# EAGLE board open-source-ruler (EAGLE 6.5.0)
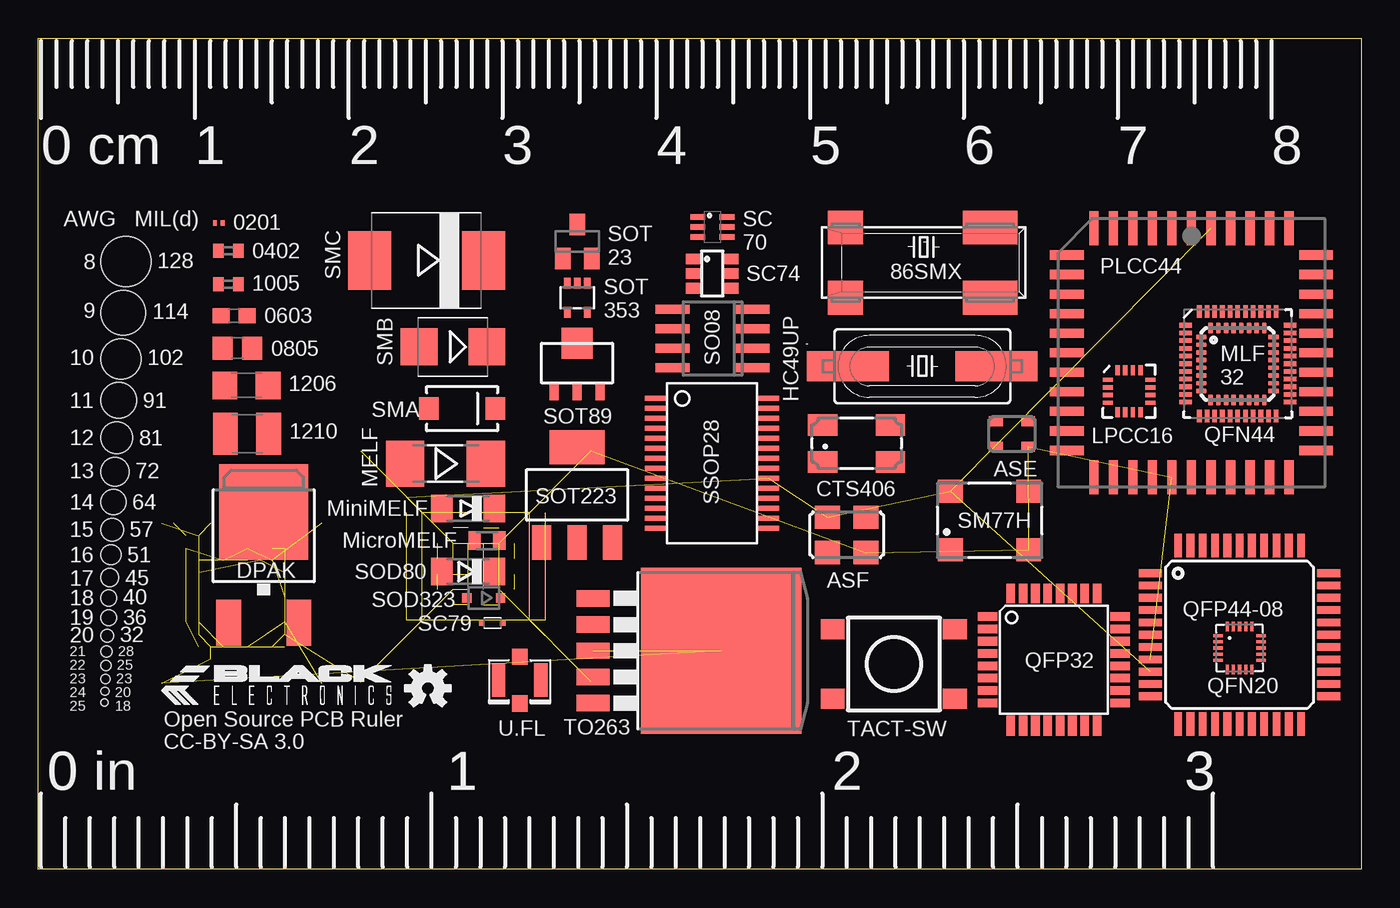
[diagram p2: board, top side]
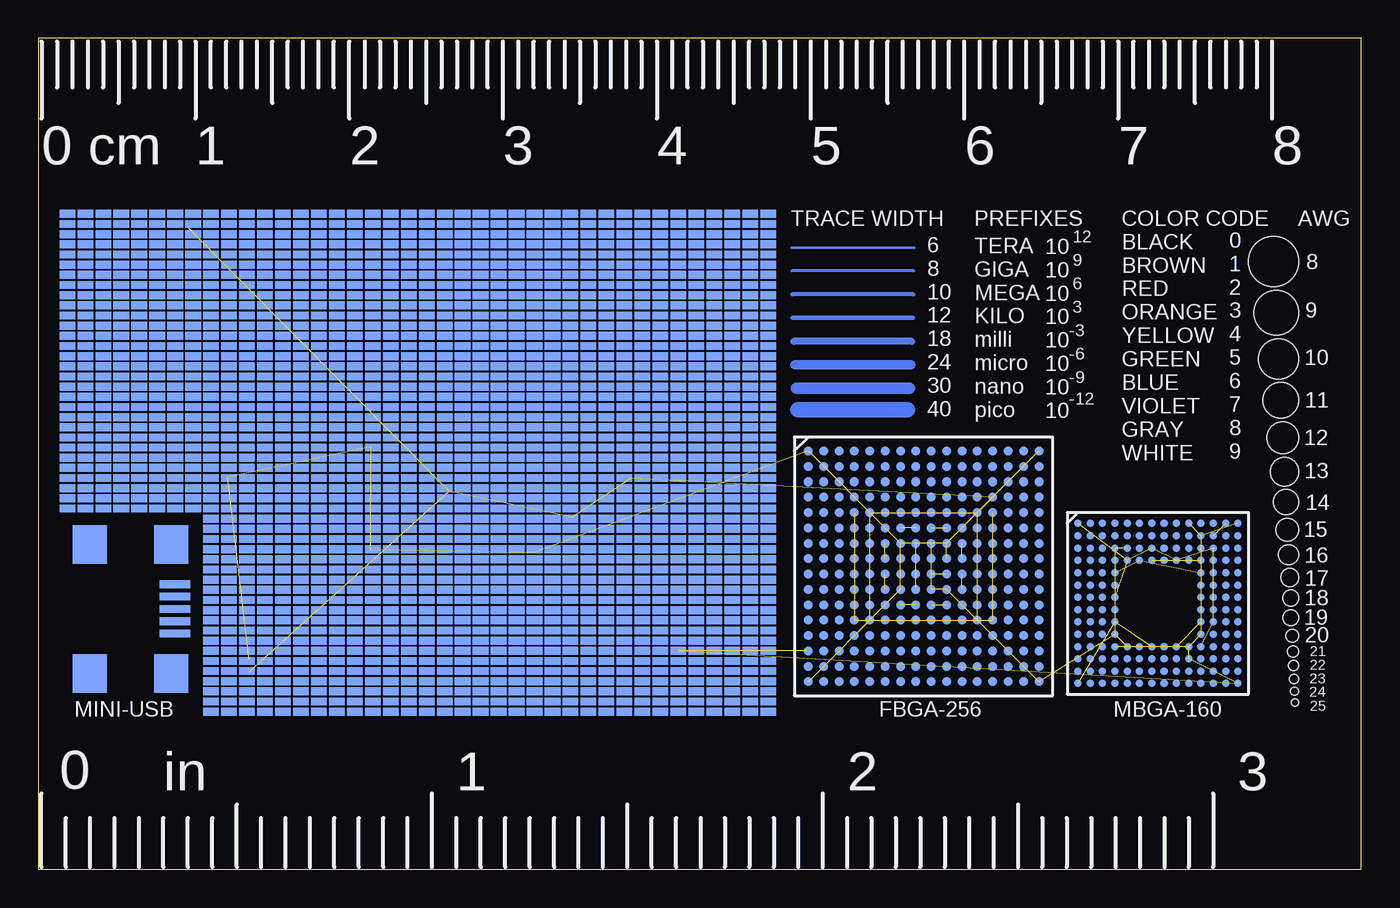
[diagram p3: board, bottom side, seen from below]

Size 86 x 54 mm. Coordinates in mm from the lower left corner, seen from the top.
Outline: 0,0 0,54 86,54 86,0 0,0
Copper layers (1*16): Top 0.035mm / dielectric 1.5mm / Bottom 0.035mm
Design rules "Fusion_eagle_rule_v1.1": minimum track width 6mil, minimum drill 12mil, track to track 6mil, track to pad 6mil, pad to pad 6mil, via to via 6mil, smd to smd 0mil, copper to edge 10mil, drill to drill 10mil, minimum pad ring 10mil, minimum via ring 6mil, stop-mask expansion 2mil, vias tented up to drill 100mil, thermal gap 10mil
Holes 3.25 mm at 5.69,39.5
Holes 2.9 mm at 5.51,36.17
Holes 2.59 mm at 5.36,33.17
Holes 2.3 mm at 5.21,30.47
Holes 2.05 mm at 5.09,28.04
Holes 1.83 mm at 4.98,25.84
Holes 1.63 mm at 4.88,23.86
Holes 1.45 mm at 4.79,22.06
Holes 1.29 mm at 4.71,20.44
Holes 1.15 mm at 4.64,18.96
Holes 1.02 mm at 4.57,17.63 4.57,16.36
Holes 0.81 mm at 4.47,15.18
Holes 0.71 mm at 4.42,14.17
Holes 0.64 mm at 4.38,13.24
Holes 0.58 mm at 4.36,12.37
Holes 0.51 mm at 4.32,11.57
Holes 0.46 mm at 4.29,10.83

## Footprints (pad centres in the part's own frame; a part is rotated, then mirrored left to right if it is on the bottom)
C0201 = smd 0.25 x 0.35: 1 -0.25,0; 2 0.25,0
C0402 = smd 0.7 x 0.9: 1 -0.65,0; 2 0.65,0
C0603 = smd 1.1 x 1: 1 -0.85,0; 2 0.85,0
C0805 = smd 1.3 x 1.5: 1 -0.95,0; 2 0.95,0
C1005 = smd 0.7 x 0.9: 1 -0.65,0; 2 0.65,0
C1206 = smd 1.6 x 1.8: 1 -1.4,0; 2 1.4,0
C1210 = smd 1.6 x 2.7: 1 -1.4,0; 2 1.4,0
MICROMELF-R = smd 0.8 x 1.2: A 0.8,0; C -0.8,0
SOD323-R = smd 0.6 x 0.6: A 1.1,0; C -1.1,0
SOD80C = smd 1.4 x 1.8: A 1.7,0; C -1.7,0
SMA-DIODE = smd 1.27 x 1.47: A -2.15,0; C 2.15,0
SMB = smd 2.4 x 2.4: A 2.2,0; C -2.2,0
SMC = smd 2.8 x 3.8: A 3.7,0; C -3.7,0
MELF-MLL41 = smd 2.5 x 3: A 2.625,0; C -2.625,0
MINIMELF = smd 1.4 x 1.8: A 1.7,0; C -1.7,0
SO08 = smd 0.6 x 2.2: 1 -1.905,-2.6; 2 -0.635,-2.6; 3 0.635,-2.6; 4 1.905,-2.6; 5 1.905,2.6; 6 0.635,2.6; 7 -0.635,2.6; 8 -1.905,2.6
SSOP28DB = smd 0.348 x 1.397: 1 -4.225,-3.656; 2 -3.575,-3.656; 3 -2.925,-3.656; 4 -2.275,-3.656; 5 -1.625,-3.656; 6 -0.975,-3.656; 7 -0.325,-3.656; 8 0.325,-3.656; 9 0.975,-3.656; 10 1.625,-3.656; 11 2.275,-3.656; 12 2.925,-3.656; 13 3.575,-3.656; 14 4.225,-3.656; 15 4.225,3.656; 16 3.575,3.656; 17 2.925,3.656; 18 2.275,3.656; 19 1.625,3.656; 20 0.975,3.656; 21 0.325,3.656; 22 -0.325,3.656; 23 -0.975,3.656; 24 -1.625,3.656; 25 -2.275,3.656; 26 -2.925,3.656; 27 -3.575,3.656; 28 -4.225,3.656
SC-74 = smd 0.7 x 1: 1 -0.95,-1.2; 2 0,-1.2; 3 0.95,-1.2; 4 0.95,1.2; 5 0,1.2; 6 -0.95,1.2
TQFP44 = smd 1.5 x 0.5: 1 -5.8,4; 2 -5.8,3.2; 3 -5.8,2.4; 4 -5.8,1.6; 5 -5.8,0.8; 6 -5.8,0; 7 -5.8,-0.8; 8 -5.8,-1.6; 9 -5.8,-2.4; 10 -5.8,-3.2; 11 -5.8,-4; 23 5.8,-4; 24 5.8,-3.2; 25 5.8,-2.4; 26 5.8,-1.6; 27 5.8,-0.8; 28 5.8,0; 29 5.8,0.8; 30 5.8,1.6; 31 5.8,2.4; 32 5.8,3.2; 33 5.8,4 | smd 0.5 x 1.5: 12 -4,-5.8; 13 -3.2,-5.8; 14 -2.4,-5.8; 15 -1.6,-5.8; 16 -0.8,-5.8; 17 0,-5.8; 18 0.8,-5.8; 19 1.6,-5.8; 20 2.4,-5.8; 21 3.2,-5.8; 22 4,-5.8; 34 4,5.8; 35 3.2,5.8; 36 2.4,5.8; 37 1.6,5.8; 38 0.8,5.8; 39 0,5.8; 40 -0.8,5.8; 41 -1.6,5.8; 42 -2.4,5.8; 43 -3.2,5.8; 44 -4,5.8
FPBGA_256 = smd 0.6 x 0.6: A1 -7.5,7.5; A2 -6.5,7.5; A3 -5.5,7.5; A4 -4.5,7.5; A5 -3.5,7.5; A6 -2.5,7.5; A7 -1.5,7.5; A8 -0.5,7.5; A9 0.5,7.5; A10 1.5,7.5; A11 2.5,7.5; A12 3.5,7.5; A13 4.5,7.5; A14 5.5,7.5; A15 6.5,7.5; A16 7.5,7.5; B1 -7.5,6.5; B2 -6.5,6.5; B3 -5.5,6.5; B4 -4.5,6.5; B5 -3.5,6.5; B6 -2.5,6.5; B7 -1.5,6.5; B8 -0.5,6.5; B9 0.5,6.5; B10 1.5,6.5; B11 2.5,6.5; B12 3.5,6.5; B13 4.5,6.5; B14 5.5,6.5; B15 6.5,6.5; B16 7.5,6.5; C1 -7.5,5.5; C2 -6.5,5.5; C3 -5.5,5.5; C4 -4.5,5.5; C5 -3.5,5.5; C6 -2.5,5.5; C7 -1.5,5.5; C8 -0.5,5.5; C9 0.5,5.5; C10 1.5,5.5; C11 2.5,5.5; C12 3.5,5.5; C13 4.5,5.5; C14 5.5,5.5; C15 6.5,5.5; C16 7.5,5.5; D1 -7.5,4.5; D2 -6.5,4.5; D3 -5.5,4.5; D4 -4.5,4.5; D5 -3.5,4.5; D6 -2.5,4.5; D7 -1.5,4.5; D8 -0.5,4.5; D9 0.5,4.5; D10 1.5,4.5; D11 2.5,4.5; D12 3.5,4.5; D13 4.5,4.5; D14 5.5,4.5; D15 6.5,4.5; D16 7.5,4.5; E1 -7.5,3.5; E2 -6.5,3.5; E3 -5.5,3.5; E4 -4.5,3.5; E5 -3.5,3.5; E6 -2.5,3.5; E7 -1.5,3.5; E8 -0.5,3.5; E9 0.5,3.5; E10 1.5,3.5; E11 2.5,3.5; E12 3.5,3.5; E13 4.5,3.5; E14 5.5,3.5; E15 6.5,3.5; E16 7.5,3.5; F1 -7.5,2.5; F2 -6.5,2.5; F3 -5.5,2.5; F4 -4.5,2.5; F5 -3.5,2.5; F6 -2.5,2.5; F7 -1.5,2.5; F8 -0.5,2.5; F9 0.5,2.5; F10 1.5,2.5; F11 2.5,2.5; F12 3.5,2.5; F13 4.5,2.5; F14 5.5,2.5; F15 6.5,2.5; F16 7.5,2.5; G1 -7.5,1.5; G2 -6.5,1.5; G3 -5.5,1.5; G4 -4.5,1.5; G5 -3.5,1.5; G6 -2.5,1.5; G7 -1.5,1.5; G8 -0.5,1.5; G9 0.5,1.5; G10 1.5,1.5; G11 2.5,1.5; G12 3.5,1.5; G13 4.5,1.5; G14 5.5,1.5; G15 6.5,1.5; G16 7.5,1.5; H1 -7.5,0.5; H2 -6.5,0.5; H3 -5.5,0.5; H4 -4.5,0.5; H5 -3.5,0.5; H6 -2.5,0.5; H7 -1.5,0.5; H8 -0.5,0.5; H9 0.5,0.5; H10 1.5,0.5; H11 2.5,0.5; H12 3.5,0.5; H13 4.5,0.5; H14 5.5,0.5; H15 6.5,0.5; H16 7.5,0.5; J1 -7.5,-0.5; J2 -6.5,-0.5; J3 -5.5,-0.5; J4 -4.5,-0.5; J5 -3.5,-0.5; J6 -2.5,-0.5; J7 -1.5,-0.5; J8 -0.5,-0.5; J9 0.5,-0.5; J10 1.5,-0.5; J11 2.5,-0.5; J12 3.5,-0.5; J13 4.5,-0.5; J14 5.5,-0.5; J15 6.5,-0.5; J16 7.5,-0.5; K1 -7.5,-1.5; K2 -6.5,-1.5; K3 -5.5,-1.5; K4 -4.5,-1.5; K5 -3.5,-1.5; K6 -2.5,-1.5; K7 -1.5,-1.5; K8 -0.5,-1.5; K9 0.5,-1.5; K10 1.5,-1.5; K11 2.5,-1.5; K12 3.5,-1.5; K13 4.5,-1.5; K14 5.5,-1.5; K15 6.5,-1.5; K16 7.5,-1.5; L1 -7.5,-2.5; L2 -6.5,-2.5; L3 -5.5,-2.5; L4 -4.5,-2.5; L5 -3.5,-2.5; L6 -2.5,-2.5; L7 -1.5,-2.5; L8 -0.5,-2.5; L9 0.5,-2.5; L10 1.5,-2.5; L11 2.5,-2.5; L12 3.5,-2.5; L13 4.5,-2.5; L14 5.5,-2.5; L15 6.5,-2.5; L16 7.5,-2.5; M1 -7.5,-3.5; M2 -6.5,-3.5; M3 -5.5,-3.5; M4 -4.5,-3.5; M5 -3.5,-3.5; M6 -2.5,-3.5; M7 -1.5,-3.5; M8 -0.5,-3.5; M9 0.5,-3.5; M10 1.5,-3.5; M11 2.5,-3.5; M12 3.5,-3.5; M13 4.5,-3.5; M14 5.5,-3.5; M15 6.5,-3.5; M16 7.5,-3.5; N1 -7.5,-4.5; N2 -6.5,-4.5; N3 -5.5,-4.5; N4 -4.5,-4.5; N5 -3.5,-4.5; N6 -2.5,-4.5; N7 -1.5,-4.5; N8 -0.5,-4.5; N9 0.5,-4.5; N10 1.5,-4.5; N11 2.5,-4.5; N12 3.5,-4.5; N13 4.5,-4.5; N14 5.5,-4.5; N15 6.5,-4.5; N16 7.5,-4.5; P1 -7.5,-5.5; P2 -6.5,-5.5; P3 -5.5,-5.5; P4 -4.5,-5.5; P5 -3.5,-5.5; P6 -2.5,-5.5; P7 -1.5,-5.5; P8 -0.5,-5.5; P9 0.5,-5.5; P10 1.5,-5.5; P11 2.5,-5.5; P12 3.5,-5.5; P13 4.5,-5.5; P14 5.5,-5.5; P15 6.5,-5.5; P16 7.5,-5.5; R1 -7.5,-6.5; R2 -6.5,-6.5; R3 -5.5,-6.5; R4 -4.5,-6.5; R5 -3.5,-6.5; R6 -2.5,-6.5; R7 -1.5,-6.5; R8 -0.5,-6.5; R9 0.5,-6.5; R10 1.5,-6.5; R11 2.5,-6.5; R12 3.5,-6.5; R13 4.5,-6.5; R14 5.5,-6.5; R15 6.5,-6.5; R16 7.5,-6.5; T1 -7.5,-7.5; T2 -6.5,-7.5; T3 -5.5,-7.5; T4 -4.5,-7.5; T5 -3.5,-7.5; T6 -2.5,-7.5; T7 -1.5,-7.5; T8 -0.5,-7.5; T9 0.5,-7.5; T10 1.5,-7.5; T11 2.5,-7.5; T12 3.5,-7.5; T13 4.5,-7.5; T14 5.5,-7.5; T15 6.5,-7.5; T16 7.5,-7.5
PLCC44 = smd 0.6 x 2.2: 1 0,8.1; 2 -1.27,8.1; 3 -2.54,8.1; 4 -3.81,8.1; 5 -5.08,8.1; 6 -6.35,8.1; 18 -6.35,-8.1; 19 -5.08,-8.1; 20 -3.81,-8.1; 21 -2.54,-8.1; 22 -1.27,-8.1; 23 0,-8.1; 24 1.27,-8.1; 25 2.54,-8.1; 26 3.81,-8.1; 27 5.08,-8.1; 28 6.35,-8.1; 40 6.35,8.1; 41 5.08,8.1; 42 3.81,8.1; 43 2.54,8.1; 44 1.27,8.1 | smd 2.2 x 0.6: 7 -8.1,6.35; 8 -8.1,5.08; 9 -8.1,3.81; 10 -8.1,2.54; 11 -8.1,1.27; 12 -8.1,0; 13 -8.1,-1.27; 14 -8.1,-2.54; 15 -8.1,-3.81; 16 -8.1,-5.08; 17 -8.1,-6.35; 29 8.1,-6.35; 30 8.1,-5.08; 31 8.1,-3.81; 32 8.1,-2.54; 33 8.1,-1.27; 34 8.1,0; 35 8.1,1.27; 36 8.1,2.54; 37 8.1,3.81; 38 8.1,5.08; 39 8.1,6.35
MBGA_160 = smd 0.5 x 0.5: A1 -5.2,5.2; A2 -4.4,5.2; A3 -3.6,5.2; A4 -2.8,5.2; A5 -2,5.2; A6 -1.2,5.2; A7 -0.4,5.2; A8 0.4,5.2; A9 1.2,5.2; A10 2,5.2; A11 2.8,5.2; A12 3.6,5.2; A13 4.4,5.2; A14 5.2,5.2; B1 -5.2,4.4; B2 -4.4,4.4; B3 -3.6,4.4; B4 -2.8,4.4; B5 -2,4.4; B6 -1.2,4.4; B7 -0.4,4.4; B8 0.4,4.4; B9 1.2,4.4; B10 2,4.4; B11 2.8,4.4; B12 3.6,4.4; B13 4.4,4.4; B14 5.2,4.4; C1 -5.2,3.6; C2 -4.4,3.6; C3 -3.6,3.6; C4 -2.8,3.6; C5 -2,3.6; C6 -1.2,3.6; C7 -0.4,3.6; C8 0.4,3.6; C9 1.2,3.6; C10 2,3.6; C11 2.8,3.6; C12 3.6,3.6; C13 4.4,3.6; C14 5.2,3.6; D1 -5.2,2.8; D2 -4.4,2.8; D3 -3.6,2.8; D4 -2.8,2.8; D5 -2,2.8; D6 -1.2,2.8; D7 -0.4,2.8; D8 0.4,2.8; D9 1.2,2.8; D10 2,2.8; D11 2.8,2.8; D12 3.6,2.8; D13 4.4,2.8; D14 5.2,2.8; E1 -5.2,2; E2 -4.4,2; E3 -3.6,2; E4 -2.8,2; E11 2.8,2; E12 3.6,2; E13 4.4,2; E14 5.2,2; F1 -5.2,1.2; F2 -4.4,1.2; F3 -3.6,1.2; F4 -2.8,1.2; F11 2.8,1.2; F12 3.6,1.2; F13 4.4,1.2; F14 5.2,1.2; G1 -5.2,0.4; G2 -4.4,0.4; G3 -3.6,0.4; G4 -2.8,0.4; G11 2.8,0.4; G12 3.6,0.4; G13 4.4,0.4; G14 5.2,0.4; H1 -5.2,-0.4; H2 -4.4,-0.4; H3 -3.6,-0.4; H4 -2.8,-0.4; H11 2.8,-0.4; H12 3.6,-0.4; H13 4.4,-0.4; H14 5.2,-0.4; J1 -5.2,-1.2; J2 -4.4,-1.2; J3 -3.6,-1.2; J4 -2.8,-1.2; J11 2.8,-1.2; J12 3.6,-1.2; J13 4.4,-1.2; J14 5.2,-1.2; K1 -5.2,-2; K2 -4.4,-2; K3 -3.6,-2; K4 -2.8,-2; K11 2.8,-2; K12 3.6,-2; K13 4.4,-2; K14 5.2,-2; L1 -5.2,-2.8; L2 -4.4,-2.8; L3 -3.6,-2.8; L4 -2.8,-2.8; L5 -2,-2.8; L6 -1.2,-2.8; L7 -0.4,-2.8; L8 0.4,-2.8; L9 1.2,-2.8; L10 2,-2.8; L11 2.8,-2.8; L12 3.6,-2.8; L13 4.4,-2.8; L14 5.2,-2.8; M1 -5.2,-3.6; M2 -4.4,-3.6; M3 -3.6,-3.6; M4 -2.8,-3.6; M5 -2,-3.6; M6 -1.2,-3.6; M7 -0.4,-3.6; M8 0.4,-3.6; M9 1.2,-3.6; M10 2,-3.6; M11 2.8,-3.6; M12 3.6,-3.6; M13 4.4,-3.6; M14 5.2,-3.6; N1 -5.2,-4.4; N2 -4.4,-4.4; N3 -3.6,-4.4; N4 -2.8,-4.4; N5 -2,-4.4; N6 -1.2,-4.4; N7 -0.4,-4.4; N8 0.4,-4.4; N9 1.2,-4.4; N10 2,-4.4; N11 2.8,-4.4; N12 3.6,-4.4; N13 4.4,-4.4; N14 5.2,-4.4; P1 -5.2,-5.2; P2 -4.4,-5.2; P3 -3.6,-5.2; P4 -2.8,-5.2; P5 -2,-5.2; P6 -1.2,-5.2; P7 -0.4,-5.2; P8 0.4,-5.2; P9 1.2,-5.2; P10 2,-5.2; P11 2.8,-5.2; P12 3.6,-5.2; P13 4.4,-5.2; P14 5.2,-5.2
SOT223 = smd 1.219 x 2.235: 1 -2.311,-3.099; 2 0,-3.099; 3 2.311,-3.099 | smd 3.6 x 2.2: 4 0,3.099
TO263-5 = smd 1.067 x 2.159: 1 -3.404,-5.791; 2 -1.702,-5.791; 3 0,-5.791; 4 1.702,-5.791; 5 3.404,-5.791 | smd 10.8 x 10.41: 6 0,2.54
SOT23 = smd 1 x 1.4: 1 -0.95,-1.1; 2 0.95,-1.1; 3 0,1.1
HC49UP = smd 5.334 x 1.93: 1 -4.826,0; 2 4.826,0
86SMX = smd 2.286 x 2.184: 1 -5.08,-2.286; 4 -5.08,2.286 | smd 3.556 x 2.184: 2 4.318,-2.286; 3 4.318,2.286
ASF = smd 1.6 x 1.5: 1 -1.25,-1.15; 2 1.25,-1.15; 3 1.25,1.15; 4 -1.25,1.15
CTS406 = smd 1.9 x 1.4: 1 -2.2,-1.2; 2 2.2,-1.2; 3 2.2,1.2; 4 -2.2,1.2
SOT89 = smd 0.58 x 1.2: 1 -1.5,-1.8; 2 0,-1.8; 3 1.5,-1.8 | smd 2 x 2: 4 0,1.3
QFN-20-0.4MM = smd 0.6 x 0.2: 1 -1.4,0.8; 2 -1.4,0.4; 3 -1.4,0; 4 -1.4,-0.4; 5 -1.4,-0.8; 11 1.4,-0.8; 12 1.4,-0.4; 13 1.4,0; 14 1.4,0.4; 15 1.4,0.8 | smd 0.2 x 0.6: 6 -0.8,-1.4; 7 -0.4,-1.4; 8 0,-1.4; 9 0.4,-1.4; 10 0.8,-1.4; 16 0.8,1.4; 17 0.4,1.4; 18 0,1.4; 19 -0.4,1.4; 20 -0.8,1.4
SM77H = smd 1.6 x 1.5: 1 -2.55,-1.9; 2 2.55,-1.9; 3 2.55,1.9; 4 -2.55,1.9
TACTILE_SWITCH_TALL = smd 1.55 x 1.3: A1 -3.975,-2.25; A2 3.975,-2.25; B1 -3.975,2.25; B2 3.975,2.25
SC79_INFINEON = smd 0.35 x 0.35: A 0.675,0; C -0.675,0
V-REG_DPACK = smd 1.6 x 3: 1 -2.28,-4.8; 3 2.28,-4.8 | smd 5.8 x 6.2: 4 0,2.38
TQFP32-08 = smd 1.27 x 0.559: 1 -4.293,2.8; 2 -4.293,2; 3 -4.293,1.2; 4 -4.293,0.4; 5 -4.293,-0.4; 6 -4.293,-1.2; 7 -4.293,-2; 8 -4.293,-2.8; 17 4.293,-2.8; 18 4.293,-2; 19 4.293,-1.2; 20 4.293,-0.4; 21 4.293,0.4; 22 4.293,1.2; 23 4.293,2; 24 4.293,2.8 | smd 0.559 x 1.27: 9 -2.8,-4.293; 10 -2,-4.293; 11 -1.2,-4.293; 12 -0.4,-4.293; 13 0.4,-4.293; 14 1.2,-4.293; 15 2,-4.293; 16 2.8,-4.293; 25 2.8,4.293; 26 2,4.293; 27 1.2,4.293; 28 0.4,4.293; 29 -0.4,4.293; 30 -1.2,4.293; 31 -2,4.293; 32 -2.8,4.293
MLF32 = smd 0.7 x 0.3: 1 -2.35,1.75; 2 -2.35,1.25; 3 -2.35,0.75; 4 -2.35,0.25; 5 -2.35,-0.25; 6 -2.35,-0.75; 7 -2.35,-1.25; 8 -2.35,-1.75; 17 2.35,-1.75; 18 2.35,-1.25; 19 2.35,-0.75; 20 2.35,-0.25; 21 2.35,0.25; 22 2.35,0.75; 23 2.35,1.25; 24 2.35,1.75 | smd 0.3 x 0.7: 9 -1.75,-2.35; 10 -1.25,-2.35; 11 -0.75,-2.35; 12 -0.25,-2.35; 13 0.25,-2.35; 14 0.75,-2.35; 15 1.25,-2.35; 16 1.75,-2.35; 25 1.75,2.35; 26 1.25,2.35; 27 0.75,2.35; 28 0.25,2.35; 29 -0.25,2.35; 30 -0.75,2.35; 31 -1.25,2.35; 32 -1.75,2.35
SOT353 = smd 0.42 x 0.7: 1 -0.65,-0.95; 2 0,-0.95; 3 0.65,-0.95; 4 0.65,0.95; 5 -0.65,0.95
SC-70 = smd 0.36 x 0.95: 1 -0.65,-0.95; 2 0,-0.95; 3 0.65,-0.95; 4 0.65,0.95; 5 0,0.95; 6 -0.65,0.95
ASE = smd 0.9 x 0.65: 1 -1.05,-0.825; 2 1.05,-0.825; 3 1.05,0.825; 4 -1.05,0.825
PADS = smd 1.016 x 0.508: P$1 -4.089,2.972; P$2 -5.258,2.311; P$3 -4.089,2.311; P$4 -2.921,2.972; P$5 -1.753,2.972; P$6 -0.584,2.972; P$7 -5.258,1.651; P$8 -2.921,2.311; P$9 -1.753,2.311; P$10 -0.584,2.311; P$11 -4.089,1.651; P$12 -5.258,0.991; P$13 -4.089,0.991; P$14 -2.921,1.651; P$15 -1.753,1.651; P$16 -0.584,1.651; P$17 -2.921,0.991; P$18 -1.753,0.991; P$19 -0.584,0.991; P$20 -5.258,0.33; P$21 -4.089,0.33; P$22 -5.258,-0.33; P$23 -4.089,-0.33; P$24 -2.921,0.33; P$25 -1.753,0.33; P$26 -0.584,0.33; P$27 -2.921,-0.33; P$28 -1.753,-0.33; P$29 -0.584,-0.33; P$30 -5.258,-0.991; P$31 -4.089,-0.991; P$32 -5.258,-1.651; P$33 -4.089,-1.651; P$34 -2.921,-0.991; P$35 -1.753,-0.991; P$36 -0.584,-0.991; P$37 -2.921,-1.651; P$38 -1.753,-1.651; P$39 -0.584,-1.651; P$40 0.584,2.972; P$41 1.753,2.972; P$42 0.584,2.311; P$43 1.753,2.311; P$44 2.921,2.972; P$45 4.089,2.972; P$46 5.258,2.972; P$47 2.921,2.311; P$48 4.089,2.311; P$49 5.258,2.311; P$50 0.584,1.651; P$51 1.753,1.651; P$52 0.584,0.991; P$53 1.753,0.991; P$54 2.921,1.651; P$55 4.089,1.651; P$56 5.258,1.651; P$57 2.921,0.991; P$58 4.089,0.991; P$59 5.258,0.991; P$60 0.584,0.33; P$61 1.753,0.33; P$62 0.584,-0.33; P$63 1.753,-0.33; P$64 2.921,0.33; P$65 4.089,0.33; P$66 5.258,0.33; P$67 2.921,-0.33; P$68 4.089,-0.33; P$69 5.258,-0.33; P$70 0.584,-0.991; P$71 1.753,-0.991; P$72 0.584,-1.651; P$73 1.753,-1.651; P$74 2.921,-0.991; P$75 4.089,-0.991; P$76 5.258,-0.991; P$77 2.921,-1.651; P$78 4.089,-1.651; P$79 5.258,-1.651; P$80 -5.258,-2.311; P$81 -4.089,-2.311; P$82 -5.258,-2.972; P$83 -4.089,-2.972; P$84 -2.921,-2.311; P$85 -1.753,-2.311; P$86 -0.584,-2.311; P$87 -2.921,-2.972; P$88 -1.753,-2.972; P$89 -0.584,-2.972; P$90 0.584,-2.311; P$91 1.753,-2.311; P$92 0.584,-2.972; P$93 1.753,-2.972; P$94 2.921,-2.311; P$95 4.089,-2.311; P$96 5.258,-2.311; P$97 2.921,-2.972; P$98 4.089,-2.972; P$99 5.258,-2.972; P$101 -5.258,2.972
QFN-44-NOPAD = smd 0.8 x 0.3: 1 -3.4,2.5; 2 -3.4,2; 3 -3.4,1.5; 4 -3.4,1; 5 -3.4,0.5; 6 -3.4,0; 7 -3.4,-0.5; 8 -3.4,-1; 9 -3.4,-1.5; 10 -3.4,-2; 11 -3.4,-2.5; 23 3.4,-2.5; 24 3.4,-2; 25 3.4,-1.5; 26 3.4,-1; 27 3.4,-0.5; 28 3.4,0; 29 3.4,0.5; 30 3.4,1; 31 3.4,1.5; 32 3.4,2; 33 3.4,2.5 | smd 0.3 x 0.8: 12 -2.5,-3.4; 13 -2,-3.4; 14 -1.5,-3.4; 15 -1,-3.4; 16 -0.5,-3.4; 17 0,-3.4; 18 0.5,-3.4; 19 1,-3.4; 20 1.5,-3.4; 21 2,-3.4; 22 2.5,-3.4; 34 2.5,3.4; 35 2,3.4; 36 1.5,3.4; 37 1,3.4; 38 0.5,3.4; 39 0,3.4; 40 -0.5,3.4; 41 -1,3.4; 42 -1.5,3.4; 43 -2,3.4; 44 -2.5,3.4
16LPCC = smd 0.65 x 0.28: 1 -1.37,0.75; 2 -1.37,0.25; 3 -1.37,-0.25; 4 -1.37,-0.75; 9 1.37,-0.75; 10 1.37,-0.25; 11 1.37,0.25; 12 1.37,0.75 | smd 0.28 x 0.65: 5 -0.75,-1.37; 6 -0.25,-1.37; 7 0.25,-1.37; 8 0.75,-1.37; 13 0.75,1.37; 14 0.25,1.37; 15 -0.25,1.37; 16 -0.75,1.37
U.FL = smd 2.2 x 0.85: P$1 0,1.375; P$2 0,-1.375 | smd 1.05 x 1: P$3 1.525,0; P$4 -1.525,0
UX60A-MB-5ST = smd 2 x 0.5: 1 2.25,1.6; 2 2.25,0.8; 3 2.25,0; 4 2.25,-0.8; 5 2.25,-1.6 | smd 2.2 x 2.5: M1 -3.3,-4.2; M2 -3.3,4.2; M3 2,4.2; M4 2,-4.2

## Placement (x,y rotation side)
0201  [C0201]  11.73,42.02 0 top
0402  [C0402]  12.35,40.21 0 top
0603  [C0603]  12.73,35.98 0 top
0805  [C0805]  12.93,33.88 0 top
1005  [C1005]  12.35,38.03 0 top
1206  [C1206]  13.54,31.45 0 top
1210  [C1210]  13.57,28.31 0 top
D1  [MICROMELF-R]  29.16,21.36 180 top
D2  [SOD323-R]  28.95,17.63 180 top
D3  [SOD80C]  27.94,19.34 180 top
D4  [SMA-DIODE]  27.55,29.94 0 top
D5  [SMB]  26.95,33.95 180 top
D6  [SMC]  25.24,39.58 180 top
D7  [MELF-MLL41]  26.47,26.37 180 top
D8  [MINIMELF]  27.94,23.44 180 top
IC1  LT1007CS8  [SO08]  43.84,34.5 90 top
IC2  FT232RLSSOP  [SSOP28DB]  43.8,26.39 270 top
IC3  MDC3105DMT1  [SC-74]  43.81,38.72 270 top
IC4  XMEGA16A4A  [TQFP44]  78.11,15.24 0 top
IC5  LFXP20E_XXF256  [FPBGA_256]  28.45,19.68 0 bottom
IC6  [PLCC44]  74.98,33.57 0 top
IC7  ADSP_BF531  [MBGA_160]  13.21,17.27 0 bottom
IC8  [SOT223]  35.03,24.33 0 top
IC9  [TO263-5]  41.86,14.2 270 top
Q1  [SOT23]  35.04,40.8 0 top
Q2  [HC49UP]  57.48,32.7 0 top
Q3  [86SMX]  57.56,39.43 0 top
Q4  ASF1  [ASF]  52.56,21.74 0 top
Q5  [CTS406]  53.2,27.68 0 top
Q6  [SOT89]  35.03,32.89 0 top
QFN20  [QFN-20-0.4MM]  78.11,14.38 0 top
QG1  SM77H  [SM77H]  61.85,22.68 0 top
S1  SWITCH-MOMENTARY-2  [TACTILE_SWITCH_TALL]  55.63,13.34 0 top
SC79  [SC79_INFINEON]  29.52,16 180 top
U1  V_REG_317DPACK  [V-REG_DPACK]  14.65,20.83 0 top
U2  ATMEGA168  [TQFP32-08]  66.03,13.62 0 top
U3  ATMEGA168MLF  [MLF32]  77.97,32.84 0 top
U4  7432SE  [SOT353]  35.04,37.15 180 top
U$1  OSHW-LOGOS  [OSHW-LOGO-S]  25.32,11.76 0 top
U$2  ADM1087SC-70  [SC-70]  43.83,41.75 270 top
U$3  ASE  [ASE]  63.31,28.29 0 top
U$4  PADS  [PADS]  67.18,13.21 0 bottom
U$5  ATMEGA32U4QFN2  [QFN-44-NOPAD]  77.98,32.86 0 top
U$6  PADS  [PADS]  78.87,39.62 0 bottom
U$7  PADS  [PADS]  78.87,33.02 0 bottom
U$8  PADS  [PADS]  78.87,26.42 0 bottom
U$9  PADS  [PADS]  55.5,13.21 0 bottom
U$10  PADS  [PADS]  67.18,39.62 0 bottom
U$11  PADS  [PADS]  67.18,33.02 0 bottom
U$12  PADS  [PADS]  67.18,26.42 0 bottom
U$13  PADS  [PADS]  67.18,19.81 0 bottom
U$14  PADS  [PADS]  55.5,19.81 0 bottom
U$15  PADS  [PADS]  55.5,26.42 0 bottom
U$16  PADS  [PADS]  55.5,33.02 0 bottom
U$17  PADS  [PADS]  55.5,39.62 0 bottom
U$18  PADS  [PADS]  43.81,39.62 0 bottom
U$19  PADS  [PADS]  43.81,33.02 0 bottom
U$20  PADS  [PADS]  43.81,26.42 0 bottom
U$21  PADS  [PADS]  43.81,19.81 0 bottom
U$22  PADS  [PADS]  43.81,13.21 0 bottom
U$23  PADS  [PADS]  69.52,19.81 0 bottom
U$24  PADS  [PADS]  69.52,13.21 0 bottom
U$25  HMC5883LSMD  [16LPCC]  70.92,31.06 0 top
U$26  U.FL  [U.FL]  31.29,12.29 270 top
U$27  LOGO_SMALL  [LOGO_SMALL]  8,10.69 0 top
X1  MINI-USB-UX60A-MB-5ST  [UX60A-MB-5ST]  79.38,16.92 0 bottom

## Tracks (layer width: path | path; a pad name or v marks a point on that pad's centre or on a via)
GND  (54 unrouted)
N$1
  Bottom 0.152: 29.06,40.41 37.03,40.41
N$2
  Bottom 0.203: 29.08,38.89 37.01,38.89
N$3
  Bottom 0.254: 29.11,37.36 36.98,37.36
N$4
  Bottom 0.305: 29.13,35.84 36.96,35.84
N$5
  Bottom 0.457: 29.21,34.31 36.88,34.31
N$6
  Bottom 0.61: 29.29,32.79 36.8,32.79
N$7
  Bottom 0.762: 29.36,31.27 36.73,31.27
N$8
  Bottom 1.016: 29.49,29.87 36.6,29.87
VCC  (12 unrouted)
VCCAUX  (3 unrouted)
VCCIO0  (1 unrouted)
VCCIO1  (1 unrouted)
VCCIO2  (1 unrouted)
VCCIO3  (1 unrouted)
VCCIO4  (1 unrouted)
VCCIO5  (1 unrouted)
VCCIO6  (1 unrouted)
VCCIO7  (1 unrouted)
VDD_EXT  (11 unrouted)
VDD_INT  (5 unrouted)
VROUT  (1 unrouted)

## Text on the board
tPlace: 0 | cm | 1 | 2 | 3 | 4 | 5 | 6 | 7 | 8 | AWG | MIL(d) | 0201 | 0402 | SC / 70 | 8 | 128 | SOT / 23 | PLCC44 | 1005 | SMC | SC74 | 86SMX | 9 | 114 | SOT / 353 | 0603 | 10 | 102 | 0805 | SMB | SO08 | 1206 | MLF / 32 | 11 | 91 | HC49UP | SMA | SOT89 | 12 | 81 | 1210 | LPCC16 | QFN44 | ASE | 13 | 72 | MELF | SOT223 | SSOP28 | CTS406 | 14 | 64 | MiniMELF | 15 | 57 | SM77H | MicroMELF | 16 | 51 | DPAK | SOD80 | 17 | 45 | ASF | 18 | 40 | SOD323 | 19 | 36 | QFP44-08 | 20 | 32 | SC79 | 21 | 28 | 22 | 25 | QFP32 | 23 | 23 | 24 | 20 | QFN20 | 25 | 18 | Open Source PCB Ruler | U.FL | TO263 | TACT-SW | CC-BY-SA 3.0 | 0 | 0 | in | 1 | 1 | 2 | 3 | 3
bPlace: 8 | 7 | 6 | 5 | 4 | 3 | 2 | 1 | cm | 0 | AWG | PREFIXES | TRACE WIDTH | 12 | 8 | 9 | 6 | 9 | 3 | -3 | 10 | -6 | -9 | 11 | -12 | 10 / 10 / 10 / 10 / 10 / 10 / 10 / 10 | TERA / GIGA / MEGA / KILO / milli / micro / nano / pico | 6 / 8 / 10 / 12 / 18 / 24 / 30 / 40 | 12 | 0 / 1 / 2 / 3 / 4 / 5 / 6 / 7 / 8 / 9 | COLOR CODE / BLACK / BROWN / RED / ORANGE / YELLOW / GREEN / BLUE / VIOLET / GRAY / WHITE | 13 | 14 | 15 | 16 | 17 | 18 | 19 | 20 | 21 | 22 | 23 | 24 | 25 | MBGA-160 | FBGA-256 | MINI-USB | 3 | 2 | 1 | in | 0